# Altium schematic sheet BidirectionalLevelShifting.SchDoc
size A4; Author: Andreas Geiger; CompanyName: Technische Hochschule Nürnberg Georg Simon Ohm; Address1: Wassertorstr. 10; Address2: 90489 Nürnberg; Address3: GERMANY; DocumentNumber: 11; SheetNumber: 11; SheetTotal: 22; CompanyName2: TH Nürnberg
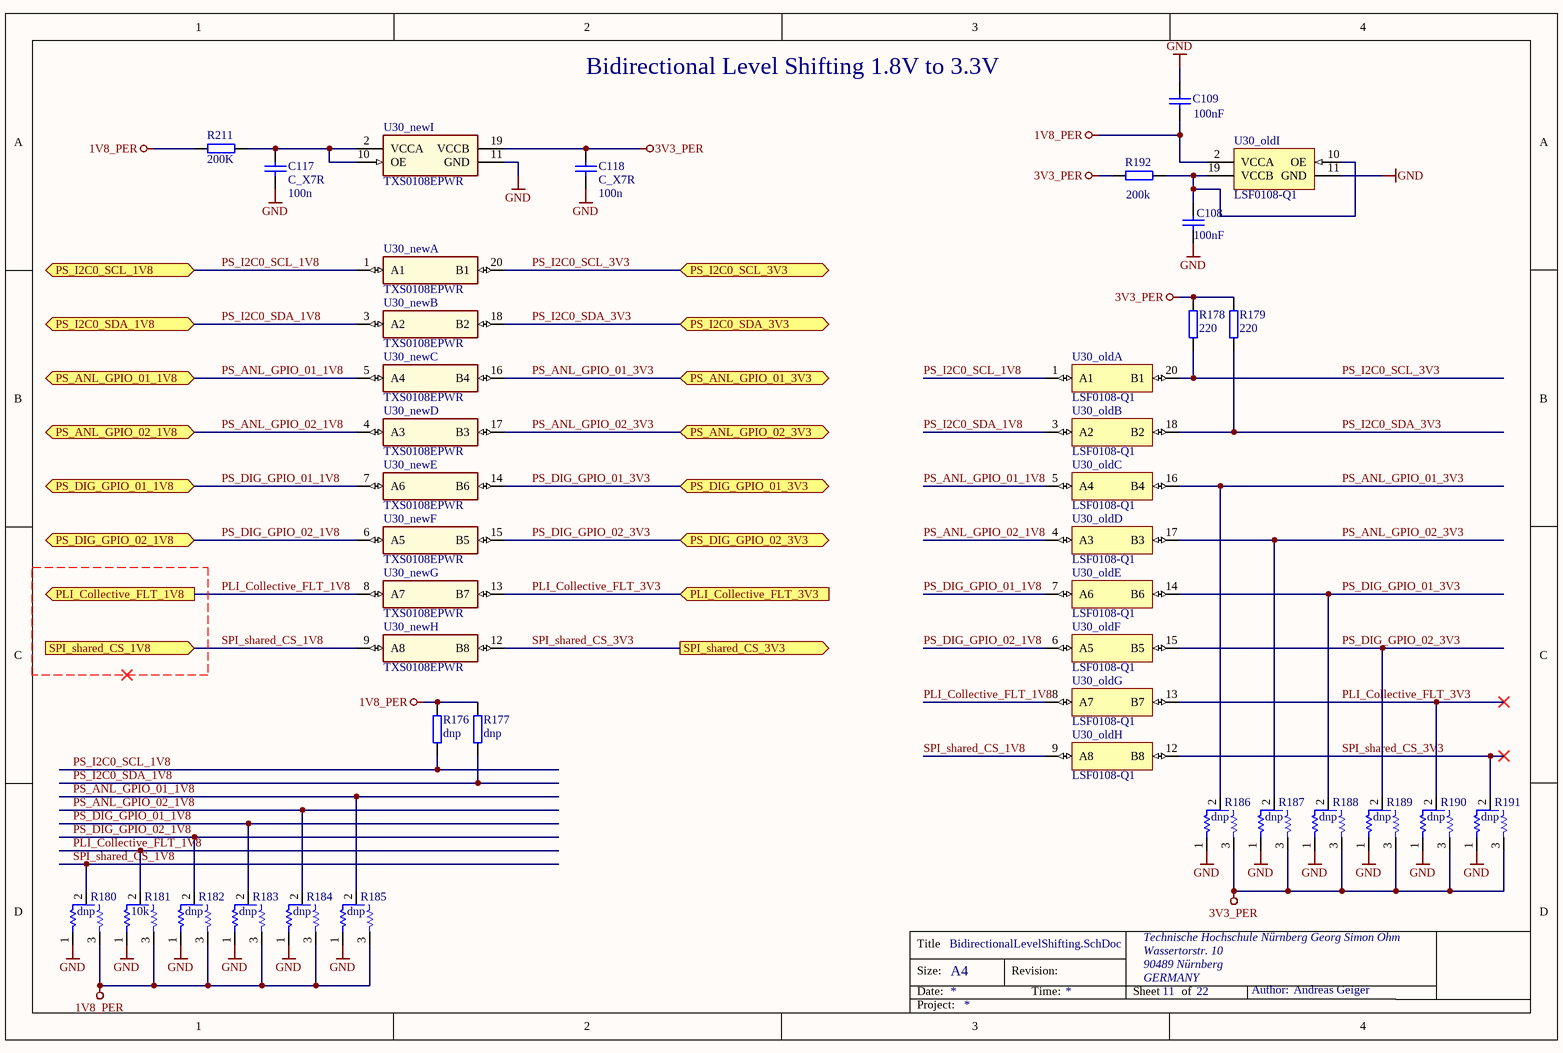
[diagram p0: BidirectionalLevelShifting.SchDoc]

## Parts
C108  100nF  [C_0603(1608)100_L]
C109  100nF  [C_0603(1608)100_L]
C117  C_X7R  value 100n  [CAPC_0603]
C118  C_X7R  value 100n  [CAPC_0603]
R176  dnp  [R_0603_N]
R177  dnp  [R_0603_N]
R178  220  [R_0603_N]
R179  220  [R_0603_N]
R180  dnp  [0603_Config]
R181  10k  [0603_Config]
R182  dnp  [0603_Config]
R183  dnp  [0603_Config]
R184  dnp  [0603_Config]
R185  dnp  [0603_Config]
R186  dnp  [0603_Config]
R187  dnp  [0603_Config]
R188  dnp  [0603_Config]
R189  dnp  [0603_Config]
R190  dnp  [0603_Config]
R191  dnp  [0603_Config]
R192  200k  [R_0603_N]
R211  200K  [R_0603_N]
U30_new  TXS0108EPWR  [TI_PW_R-PDSO-G20_L]  (parts A,B,C,D,E,F,G,H,I of 9)
U30_old  LSF0108-Q1  [TI_PW_R-PDSO-G20_L]  (parts A,B,C,D,E,F,G,H,I of 9)

## Ports
PLI_Collective_FLT_1V8 (out), PLI_Collective_FLT_3V3 (in), PS_ANL_GPIO_01_1V8 (bidir), PS_ANL_GPIO_01_3V3 (bidir), PS_ANL_GPIO_02_1V8 (bidir), PS_ANL_GPIO_02_3V3 (bidir), PS_DIG_GPIO_01_1V8 (bidir), PS_DIG_GPIO_01_3V3 (bidir), PS_DIG_GPIO_02_1V8 (bidir), PS_DIG_GPIO_02_3V3 (bidir), PS_I2C0_SCL_1V8 (bidir), PS_I2C0_SCL_3V3 (bidir), PS_I2C0_SDA_1V8 (bidir), PS_I2C0_SDA_3V3 (bidir), SPI_shared_CS_1V8 (in), SPI_shared_CS_3V3 (out)

## Nets
1V8_PER: C109.2 R176.1 R177.1 R180.3 R181.3 R182.3 R183.3 R184.3 R185.3 R211.1 U30_old.2(VCCA)
3V3_PER: C118.2 R178.1 R179.1 R186.3 R187.3 R188.3 R189.3 R190.3 R191.3 R192.2 U30_new.19(VCCB)
GND: C108.1 C109.1 C117.1 C118.1 R180.1 R181.1 R182.1 R183.1 R184.1 R185.1 R186.1 R187.1 R188.1 R189.1 R190.1 R191.1 U30_new.11(GND) U30_old.11(GND)
PLI_Collective_FLT_1V8: R181.2 U30_new.8(A7) U30_old.8(A7) ; port PLI_Collective_FLT_1V8
PLI_Collective_FLT_3V3: R190.2 U30_new.13(B7) U30_old.13(B7) ; port PLI_Collective_FLT_3V3
PS_ANL_GPIO_01_1V8: R185.2 U30_new.5(A4) U30_old.5(A4) ; port PS_ANL_GPIO_01_1V8
PS_ANL_GPIO_01_3V3: R186.2 U30_new.16(B4) U30_old.16(B4) ; port PS_ANL_GPIO_01_3V3
PS_ANL_GPIO_02_1V8: R184.2 U30_new.4(A3) U30_old.4(A3) ; port PS_ANL_GPIO_02_1V8
PS_ANL_GPIO_02_3V3: R187.2 U30_new.17(B3) U30_old.17(B3) ; port PS_ANL_GPIO_02_3V3
PS_DIG_GPIO_01_1V8: R183.2 U30_new.7(A6) U30_old.7(A6) ; port PS_DIG_GPIO_01_1V8
PS_DIG_GPIO_01_3V3: R188.2 U30_new.14(B6) U30_old.14(B6) ; port PS_DIG_GPIO_01_3V3
PS_DIG_GPIO_02_1V8: R182.2 U30_new.6(A5) U30_old.6(A5) ; port PS_DIG_GPIO_02_1V8
PS_DIG_GPIO_02_3V3: R189.2 U30_new.15(B5) U30_old.15(B5) ; port PS_DIG_GPIO_02_3V3
PS_I2C0_SCL_1V8: R176.2 U30_new.1(A1) U30_old.1(A1) ; port PS_I2C0_SCL_1V8
PS_I2C0_SCL_3V3: R178.2 U30_new.20(B1) U30_old.20(B1) ; port PS_I2C0_SCL_3V3
PS_I2C0_SDA_1V8: R177.2 U30_new.3(A2) U30_old.3(A2) ; port PS_I2C0_SDA_1V8
PS_I2C0_SDA_3V3: R179.2 U30_new.18(B2) U30_old.18(B2) ; port PS_I2C0_SDA_3V3
SPI_shared_CS_1V8: R180.2 U30_new.9(A8) U30_old.9(A8) ; port SPI_shared_CS_1V8
SPI_shared_CS_3V3: R191.2 U30_new.12(B8) U30_old.12(B8) ; port SPI_shared_CS_3V3
NetC108_2: C108.2 R192.1 U30_old.10(OE) U30_old.19(VCCB)
NetC117_2: C117.2 R211.2 U30_new.2(VCCA) U30_new.10(OE)

## Notes on the sheet
- Bidirectional Level Shifting 1.8V to 3.3V
- Title
- Size:
- Date:
- A4
- Revision:
- Time:
- Sheet
- of
- Author:
- Project:

## Library data of the parts
C108 C109 = C_0603: Capacitor 0603; MPN: MC0603B104K500CT; Tolerance: ±10%; Voltage: 50V; MF: Multicomp; Dielectric: X7R; Value: 100nF; Package: 0603; Created: 2018_09_13_AGeiger; Supplier Part Number 1: 1759122; Supplier 1: Farnell
C117 C118 = C_X7R_SMALL: Standard X7R SMD capacitor. This kind of dielectricum should be used for decoupling applications. Bigger capacity is available but not for the given voltage rating.; MPN: C<pkg[inch]><2d cap [pf] + #zeros><ToleranceSym><VoltageSym>RACTU; MF: KEMET; Parameter1: 5; Parameter1Desc: Voltage Symbol; Parameter2: J; Parameter2Desc: Tolerance Symbol; MaxVoltage: 100; MinCap: 10p; Created: 2019-12-08_Thilo_Wendt; Package: CAPC_0603; HelpURL: https://content.kemet.com/datasheets/KEM_C1002_X7R_SMD.pdf; MaxCap: 100n; ComponentLink1Description: Datasheet; ComponentLink1URL: https://content.kemet.com/datasheets/KEM_C1002_X7R_SMD.pdf; Supplier Link 1: https://de.farnell.com/w/c/passive-bauelemente/kondensatoren/keramikkondensatoren/keramik-vielschichtkondensatoren-mlcc-smd?brand=kemet&kapazitatstoleranz=posneg-10pc&dielektrikum=x7r; Supplier 2: Mouser; Supplier Part Number 2: 80-<MPN>
R176 R177 = R_0603: SMD Resistor 0603; MPN: MCSR06X4991FTL; Value: 4k99; Tolerance: 1%; Voltage: 75V; Power: 100mW; MF: Multicomp; Assembly: dnp; Package: 0603; Created: 2018_09_06_AGeiger; Supplier 1: Farnell; Supplier Part Number 1: 2074271
R178 R179 = R_0603: SMD Resistor 0603; MPN: MCWR06X2200FTL; Tolerance: 1%; Voltage: 50V; Power: 100mW; MF: Multicomp; Package: 0603; Value: 220; Created: 2019_10_12_AGeiger; Supplier 1: Farnell; Supplier Part Number 1: 2447298
R180 R182-R191 = R_config: Solder 0603 resistor/jumper between pads 1 and 2 for standard function. Solter resistor between pads 2 and 3 for alternative function; MPN: MCWR06X1002FTL; Value: 10k; MF: Multicomp; Voltage: 50V; Power: 100mW; Tolerance: 1%; Assembly: dnp; Created: 2018_09_04_AGeiger; Package: 0603; Supplier Part Number 1: 2447230; Supplier 1: Farnell
R181 = R_config: Solder 0603 resistor/jumper between pads 1 and 2 for standard function. Solter resistor between pads 2 and 3 for alternative function; MPN: MCWR06X1002FTL; MF: Multicomp; Voltage: 50V; Power: 100mW; Tolerance: 1%; Created: 2018_09_04_AGeiger; Value: 10k; Package: 0603; Supplier Part Number 1: 2447230; Supplier 1: Farnell
R192 = R_0603: SMD Resistor 0603; MPN: MCWR06X2003FTL; Tolerance: 1%; Voltage: 50V; Power: 100mW; MF: Multicomp; Package: 0603; Value: 200k; Created: 2018_09_06_AGeiger; Supplier 1: Farnell; Supplier Part Number 1: 2447291
R211 = R_0603: SMD Resistor 0603; Tolerance: 1%; Voltage: tbd; Package: 0603; Value: 200K; Created: 2018_09_06_AGeiger; Power: tbd; Supplier 1: *; Supplier Part Number 1: *
U30_new = TI-TXS0108EPWR: Integrated Circuit; MPN: TXS0108EQPWRQ1; Max Voltage: 3.6; MF: Texas Instruments; ComponentLink1Description: Datasheet; ComponentLink1URL: http://www.ti.com/lit/gpn/txs0108e-q1; Created: 2020-05-05_Thilo_Wendt; HelpURL: http://www.ti.com/product/TXS0108E-Q1?keyMatch=TXS0108&tisearch=Search-EN-everything&usecase=part-number; Supplier 1: Mouser; Supplier Part Number 1: 595-TXS0108EQPWRQ1; Supplier 2: RS; Supplier 3: Digi-Key; Supplier Part Number 2: 709-4639; Supplier Part Number 3: 296-23011-1-ND; Value: TXS0108EPWR
U30_old = TI-LSF0108PWR: Automotive 8-Channel Mulit-Voltage Level Translator; MPN: LSF0108QPWRQ1; MF: Texas Instruments; Value: LSF0108-Q1; Created: 2018_09_17_AGeiger; Supplier 1: Mouser; Supplier Part Number 1: 595-LSF0108QPWRQ1; ComponentLink1Description: Datasheet; ComponentLink1URL: http://www.ti.com/lit/ds/symlink/lsf0108-q1.pdf; Package: TI_PW_R-PDSO-G20_L